# EAGLE design digibaro_v2 (EAGLE 9.4.0)
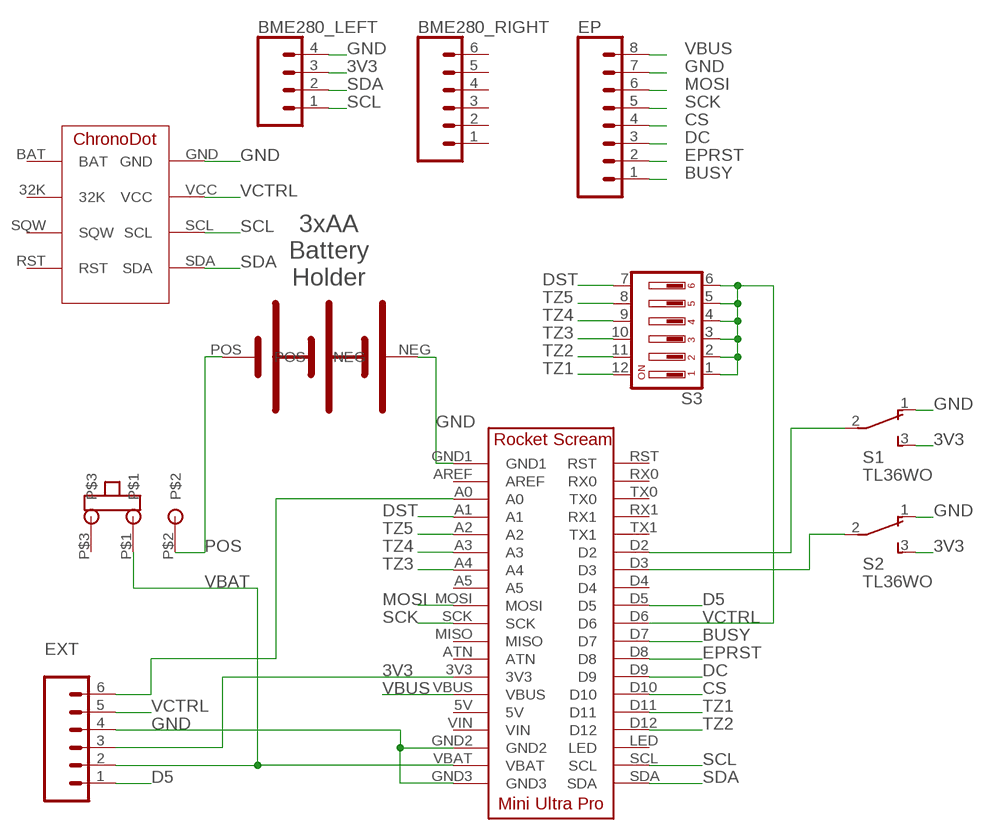
[diagram p0: schematic, sheet 1]

## Parts
BME280_LEFT  CONN_04  [1X04]
BME280_RIGHT  CONN_06SILK_FEMALE_PTH  [1X06]
EP  CONN_08"  [1X08]
EXT  CONN_06SILK_FEMALE_PTH  [1X06]
S1  TL36WO  [TL3XWO]
S2  TL36WO  [TL3XWO]
S3  DA06  [DA-06]
U$1  BATTERY-HOLDER_3AA  [BATTERY-HOLDER_3AA]
U$2  SLIDE-SWITCHNKKMINIATURE  [MS12ANG03]
U$3  ULTRA-MINI-PRO  [ULTRA-MINI-PRO_RECEIVER]
U$4  CHRONODOT  [CHRONODOT_RECEIVER]

## Nets
3V3: BME280_LEFT.3 EXT.3 S1.3(S) S2.3(S) U$3.3V3
A0: EXT.6 U$3.A0
BUSY: EP.1 U$3.D7
CS: EP.4 U$3.D10
D5: EXT.1 U$3.D5
DC: EP.3 U$3.D9
DST: S3.7 U$3.A1
EPRST: EP.2 U$3.D8
GND: BME280_LEFT.4 EP.7 EXT.4 S1.1(O) S2.1(O) U$1.NEG U$3.GND1 U$3.GND2 U$3.GND3 U$4.GND
MOSI: EP.6 U$3.MOSI
N$6: S1.2(P) U$3.D2
N$7: S2.2(P) U$3.D3
POS: U$1.POS U$2.P$2
SCK: EP.5 U$3.SCK
SCL: BME280_LEFT.1 U$3.SCL U$4.SCL
SDA: BME280_LEFT.2 U$3.SDA U$4.SDA
TZ1: S3.12 U$3.D11
TZ2: S3.11 U$3.D12
TZ3: S3.10 U$3.A4
TZ4: S3.9 U$3.A3
TZ5: S3.8 U$3.A2
VBAT: EXT.2 U$2.P$1 U$3.VBAT
VBUS: EP.8 U$3.VBUS
VCTRL: EXT.5 S3.1 S3.2 S3.3 S3.4 S3.5 S3.6 U$3.D6 U$4.VCC
Unconnected: BME280_RIGHT.1 BME280_RIGHT.2 BME280_RIGHT.3 BME280_RIGHT.4 BME280_RIGHT.5 BME280_RIGHT.6 U$2.P$3 U$3.5V U$3.A5 U$3.AREF U$3.ATN U$3.D4 U$3.LED U$3.MISO U$3.RST U$3.RX0 U$3.RX1 U$3.TX0 U$3.TX1 U$3.VIN U$4.32K U$4.BAT U$4.RST U$4.SQW

## Library data of the parts
BME280_LEFT = SparkFun-Connectors:CONN_04: Multi connection point. Often used as Generic Header-pin footprint for 0.1 inch spaced/style header connections On any of the 0.1 inch spaced packages, you can populate with these: Break Away Headers - Straight <https://www.sparkfun.com/products/116> (PRT-00116) Break Away Male Headers - Right Angle <https://www.sparkfun.com/products/553> (PRT-00553) Female Headers <https://www.sparkfun.com/products/115> (PRT-00115) Break Away Headers - Machine Pin <https://www.sparkfun.com/products/117> (PRT-00117) Break Away Female Headers - Swiss Machine Pin <https://www.sparkfun.com/products/743> (PRT-00743) For SCREWTERMINALS and SPRING TERMINALS visit here: Screw Terimnals on SparkFun.com <https://www.sparkfun.com/search/results?term=Screw+Terminals> (5mm/3.5mm/2.54mm spacing) This device is also useful as a general connection point to wire up your design to another part of your project. Our various solder wires solder well into these plated through hole pads. Hook-Up Wire - Assortment (Stranded, 22 AWG) <https://www.sparkfun.com/products/11375> (PRT-11375) Hook-Up Wire - Assortment (Solid Core, 22 AWG) <https://www.sparkfun.com/products/11367> (PRT-11367) View the entire wire category on our website here <https://www.sparkfun.com/categories/141> Special notes: Molex polarized connector foot print use with SKU : PRT-08231 with associated crimp pins and housings. 1MM SMD Version SKU: PRT-10208; PROD_ID: CONN-09696
BME280_RIGHT EXT = SparkFun-Connectors:CONN_06: Multi connection point. Often used as Generic Header-pin footprint for 0.1 inch spaced/style header connections On any of the 0.1 inch spaced packages, you can populate with these: Break Away Headers - Straight <https://www.sparkfun.com/products/116> (PRT-00116) Break Away Male Headers - Right Angle <https://www.sparkfun.com/products/553> (PRT-00553) Female Headers <https://www.sparkfun.com/products/115> (PRT-00115) Break Away Headers - Machine Pin <https://www.sparkfun.com/products/117> (PRT-00117) Break Away Female Headers - Swiss Machine Pin <https://www.sparkfun.com/products/743> (PRT-00743) Arduino Stackable Header - 6 Pin <https://www.sparkfun.com/products/9280> (PRT-09280) For SCREWTERMINALS and SPRING TERMINALS visit here: Screw Terimnals on SparkFun.com <https://www.sparkfun.com/search/results?term=Screw+Terminals> (5mm/3.5mm/2.54mm spacing) This device is also useful as a general connection point to wire up your design to another part of your project. Our various solder wires solder well into these plated through hole pads. Hook-Up Wire - Assortment (Stranded, 22 AWG) <https://www.sparkfun.com/products/11375> (PRT-11375) Hook-Up Wire - Assortment (Solid Core, 22 AWG) <https://www.sparkfun.com/products/11367> (PRT-11367) View the entire wire category on our website here <https://www.sparkfun.com/categories/141>; PROD_ID: CONN-08437
EP = SparkFun-Connectors:CONN_08: Multi connection point. Often used as Generic Header-pin footprint for 0.1 inch spaced/style header connections On any of the 0.1 inch spaced packages, you can populate with these: Break Away Headers - Straight <https://www.sparkfun.com/products/116> (PRT-00116) Break Away Male Headers - Right Angle <https://www.sparkfun.com/products/553> (PRT-00553) Female Headers <https://www.sparkfun.com/products/115> (PRT-00115) Break Away Headers - Machine Pin <https://www.sparkfun.com/products/117> (PRT-00117) Break Away Female Headers - Swiss Machine Pin <https://www.sparkfun.com/products/743> (PRT-00743) Arduino Stackable Header - 8 Pin <https://www.sparkfun.com/products/9279> (PRT-09279) For SCREWTERMINALS and SPRING TERMINALS visit here: Screw Terimnals on SparkFun.com <https://www.sparkfun.com/search/results?term=Screw+Terminals> (5mm/3.5mm/2.54mm spacing) This device is also useful as a general connection point to wire up your design to another part of your project. Our various solder wires solder well into these plated through hole pads. Hook-Up Wire - Assortment (Stranded, 22 AWG) <https://www.sparkfun.com/products/11375> (PRT-11375) Hook-Up Wire - Assortment (Solid Core, 22 AWG) <https://www.sparkfun.com/products/11367> (PRT-11367) View the entire wire category on our website here <https://www.sparkfun.com/categories/141> Special notes: Molex polarized connector foot print use with SKU : PRT-08231 with associated crimp pins and housings. 1MM SMD Version SKU: PRT-10208 NOTES ON THE VARIANTS LOCK and LOCK_LONGPADS... This footprint was designed to help hold the alignment of a through-hole component (i.e. 6-pin header) while soldering it into place. You may notice that each hole has been shifted either up or down by 0.005 of an inch from it's more standard position (which is a perfectly straight line). This slight alteration caused the pins (the squares in the middle) to touch the edges of the holes. Because they are alternating, it causes a "brace" to hold the component in place. 0.005 has proven to be the perfect amount of "off-center" position when using our standard breakaway headers. Although looks a little odd when you look at the bare footprint, once you have a header in there, the alteration is very hard to notice. Also,if you push a header all the way into place, it is covered up entirely on the bottom side.; PROD_ID: CONN-08438
S1 S2 = switch:TL36WO: TINY SWITCH ON - ON Source: http://www2.produktinfo.conrad.com/datenblaetter/700000-724999/705152-da-01-de-Subminiaturschalter_TL_36WO.pdf
S3 = switch-dil:DA06: DIL/CODE SWITCH; MPN: MCDA06; OC_FARNELL: 9471553; OC_NEWARK: 26M1091
U$1 = flupes:BATTERY-HOLDER_3AA
U$2 = flupes:SLIDE-SWITCH
U$3 = flupes:ULTRA-MINI-PRO
U$4 = flupes:CHRONODOT

## Board
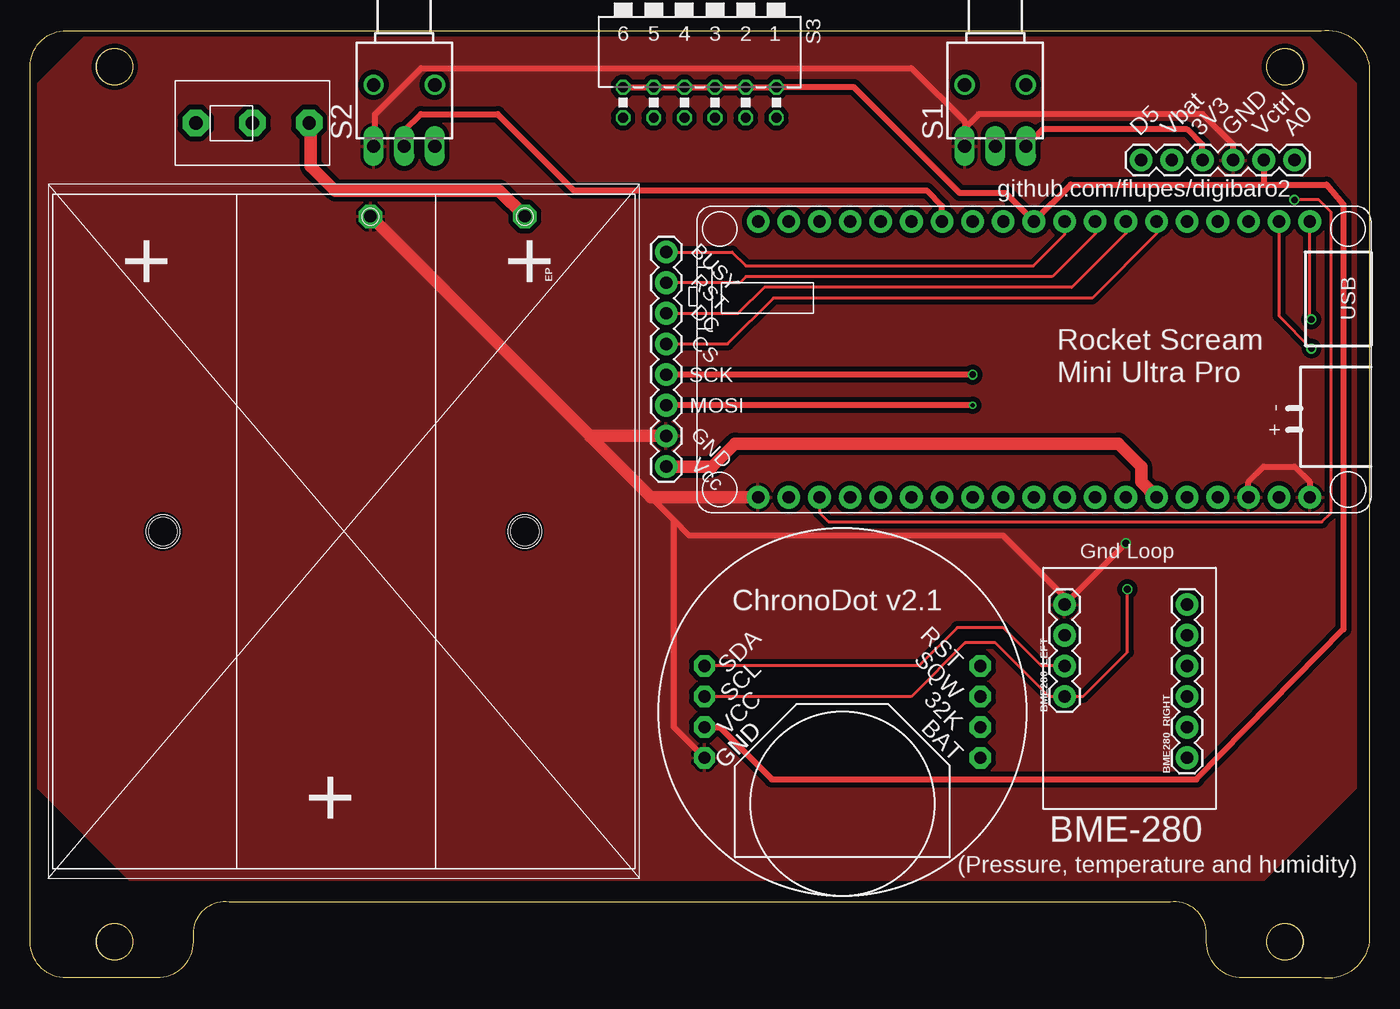
[diagram p1: board, top side]
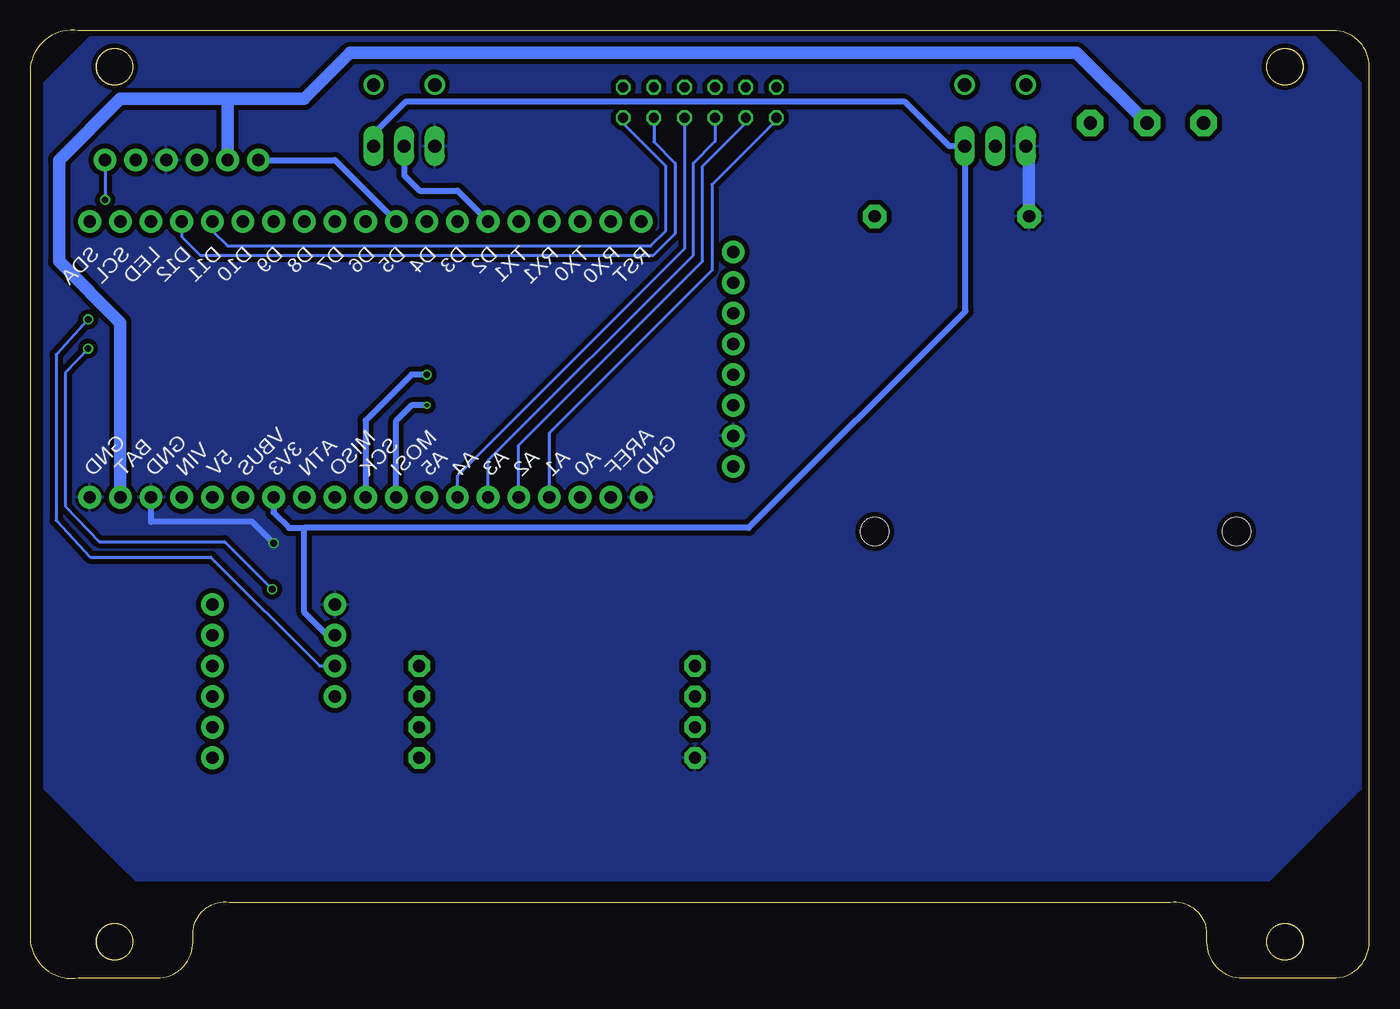
[diagram p2: board, bottom side, seen from below]

Size 111 x 78.56 mm. Coordinates in mm from the lower left corner, seen from the top.
Outline: 3,78.53 107,78.53 arc-90 111,75.53 111,3.03 arc-90 107,0.03 100.5,0.03 arc-90 97.5,3.03 97.5,3.95 arc90 94.5,6.32 16.5,6.32 arc90 13.5,3.95 13.5,3.03 arc-90 10.5,0.03 3,0.03 arc-90 0,3.03 0,75.53 arc-90 3,78.53
Outline: circle at 104,75.53 radius 1.5
Outline: circle at 7,75.53 radius 1.5
Outline: circle at 104,3.03 radius 1.5
Outline: circle at 7,3.03 radius 1.5
Copper layers (1*16): Top 0.035559375mm / dielectric 1.6mm / Bottom 0.035559375mm
Design rules "oshpark-2layer": minimum track width 6mil, minimum drill 10mil, track to track 6mil, track to pad 6mil, pad to pad 6mil, via to via 6mil, smd to smd 6mil, copper to edge 15mil, drill to drill 6mil, minimum pad ring 5mil, minimum via ring 5mil, stop-mask expansion 2.5mil, vias tented up to drill 0mil, thermal gap 10mil
Holes 3 mm at 7,75.53 7,3.03 104,75.53 104,3.03

### Footprints (pad centres in the part's own frame; a part is rotated, then mirrored left to right if it is on the bottom)
1X04 = drill 1.016 pad 1.88: 1 0,0; 2 2.54,0; 3 5.08,0; 4 7.62,0
1X06 = drill 1.016 pad 1.88: 1 0,0; 2 2.54,0; 3 5.08,0; 4 7.62,0; 5 10.16,0; 6 12.7,0
1X08 = drill 1.016 pad 1.88: 1 0,0; 2 2.54,0; 3 5.08,0; 4 7.62,0; 5 10.16,0; 6 12.7,0; 7 15.24,0; 8 17.78,0
TL3XWO = drill 1.1 pad 1.422 long: 1 -2.54,-5.08; 2 0,-5.08; 3 2.54,-5.08 | drill 1.1 pad 1.676: M1 -2.54,0; M2 2.54,0
DA-06 = drill 0.813 octagon: 1 -6.35,-1.27; 2 -3.81,-1.27; 3 -1.27,-1.27; 4 1.27,-1.27; 5 3.81,-1.27; 6 6.35,-1.27; 7 6.35,1.27; 8 3.81,1.27; 9 1.27,1.27; 10 -1.27,1.27; 11 -3.81,1.27; 12 -6.35,1.27
BATTERY-HOLDER_3AA = drill 1 pad 1.93 octagon: NEG 26.1,-2.2; POS 26.1,-15 | hole 2.37: 0,15; 0,-15
MS12ANG03 = drill 1.1 pad 2.184 octagon: P$1 0,0; P$2 -4.7,0; P$3 4.7,0
ULTRA-MINI-PRO_RECEIVER = drill 1.016 pad 1.88: 3V3 -11.43,-7.62; 5V -11.43,-12.7; A0 -11.43,17.78; A1 -11.43,15.24; A2 -11.43,12.7; A3 -11.43,10.16; A4 -11.43,7.62; A5 -11.43,5.08; AREF -11.43,20.32; ATN -11.43,-5.08; D2 11.43,10.16; D3 11.43,7.62; D4 11.43,5.08; D5 11.43,2.54; D6 11.43,0; D7 11.43,-2.54; D8 11.43,-5.08; D9 11.43,-7.62; D10 11.43,-10.16; D11 11.43,-12.7; D12 11.43,-15.24; GND1 -11.43,22.86; GND2 -11.43,-17.78; GND3 -11.43,-22.86; LED 11.43,-17.78; MISO -11.43,-2.54; MOSI -11.43,2.54; RST 11.43,22.86; RX0 11.43,20.32; RX1 11.43,15.24; SCK -11.43,0; SCL 11.43,-20.32; SDA 11.43,-22.86; TX0 11.43,17.78; TX1 11.43,12.7; VBAT -11.43,-20.32; VBUS -11.43,-10.16; VIN -11.43,-15.24
CHRONODOT_RECEIVER = drill 1.016 pad 1.778 octagon: 32K -11.43,1.27; BAT -11.43,3.81; GND 11.43,3.81; RST -11.43,-3.81; SCL 11.43,-1.27; SDA 11.43,-3.81; SQW -11.43,-1.27; VCC 11.43,1.27

### Placement (x,y rotation side)
BME280_LEFT  85.74,23.35 90 top
BME280_RIGHT  95.9,18.27 90 top
EP  52.72,60.18 270 top
EXT  92.09,67.8 0 top
S1  80,74.03 0 top
S2  31,74.03 0 top
S3  55.5,72.57 180 top
U$1  26,37.03 90 top
U$2  18.43,70.88 180 top
U$3  83.2,51.29 90 top
U$4  67.33,22.08 180 top

### Tracks (layer width: path | path; a pad name or v marks a point on that pad's centre or on a via)
3V3
  Top 0.508: EXT.3 97.17,69.07 95.9,70.34 83.93,70.34 S1.3
  Bottom 0.508: BME280_LEFT.3 86.38,28.43 88.28,30.34 88.28,37.32 | 88.28,37.32 51.45,37.32 33.48,55.29 33.48,68.89 S2.3 34.82,68.95 38.5,72.63 79.9,72.63 82.54,69.99 S1.3 | U$3.3V3 90.82,38.59 89.55,37.32 88.28,37.32
A0  (via drill 0.55)
  Top 0.254: U$3.A0 65.42,38.59 66.18,37.83 107.08,37.83 107.84,38.59 107.84,63.48 106.82,64.5 v104.79,64.5
  Bottom 0.254: EXT.6 v104.79,64.5
BUSY
  Top 0.254: EP.1 58.18,60.18 59.32,59.04 83.16,59.04 85.74,61.62 U$3.D7
CS
  Top 0.254: EP.4 57.8,52.56 61.61,56.37 88.03,56.37 93.36,61.71 U$3.D10
D5
  Bottom 0.508: EXT.1 85.74,67.8 U$3.D5
DC
  Top 0.254: EP.3 58.69,55.1 60.85,57.26 86.34,57.26 90.82,61.74 U$3.D9
DST
  Bottom 0.254: S3.7 49.15,71.12 54.5,65.77 54.5,58.66 67.96,45.2 U$3.A1
EPRST
  Top 0.254: EP.2 58.82,57.64 59.32,58.15 84.72,58.15 88.28,61.71 U$3.D8
GND  (via drill 0.55)
  Top 0.508: U$4.GND 53.35,20.81 53.35,37.96 | EXT.4 99.71,69.07 97.17,71.61 78.63,71.61 77.46,70.44 S1.1 77.46,71 73.04,75.42 32.4,75.42 28.59,71.61 28.59,69.08 S2.1 | 53.35,37.96 54.62,36.69 80.66,36.69 85.74,31.61 BME280_LEFT.4 v90.82,36.05 | 53.35,37.96 51.45,39.86 | U$3.GND2 100.98,41.13 102.25,42.4 104.79,42.4 106.06,41.13 U$3.GND3
  Top 1.016: 46.39,44.94 EP.7 | 46.39,44.94 U$1.NEG | U$3.GND1 51.45,39.86 46.39,44.92 46.39,44.94
  Bottom 0.508: 28.2,68.69 S2.1 | U$3.GND2 100.98,37.83 92.6,37.83 v90.82,36.05
  Bottom 1.016: U$1.NEG 28.2,68.69
  pour Top (isolate 0.406): 5.73,77.96 106.06,77.96 109.87,74.15 109.87,15.73 102.25,8.11 8.27,8.11 0.65,15.73 0.65,74.15 4.46,77.96
  pour Bottom (isolate 0.406): 4.46,77.96 106.06,77.96 109.87,74.15 109.87,15.73 103.52,9.38 102.25,8.11 8.27,8.11 0.65,15.73 0.65,74.15
MOSI  (via drill 0.35)
  Top 0.508: v78.12,47.48 EP.6
  Bottom 0.508: U$3.MOSI 80.66,46.21 79.39,47.48 v78.12,47.48
N$6
  Bottom 0.508: S1.2 80,66.53 78.73,65.26 75.58,65.26 U$3.D2
N$7
  Top 0.508: S2.2 31,70.21 32.4,71.61 38.75,71.61 45.1,65.26 74.31,65.26 75.58,63.99 U$3.D3
POS
  Top 1.016: U$1.POS 38.87,65.26 25.29,65.26 23.26,67.29 23.26,70.76 U$2.P$2
SCK  (via drill 0.55)
  Top 0.508: v78.12,50.02 EP.5
  Bottom 0.508: U$3.SCK 83.2,46.21 79.39,50.02 v78.12,50.02
SCL  (via drill 0.55)
  Top 0.254: U$4.SCL 73.04,23.35 77.48,27.8 80.03,27.8 84.47,23.35 BME280_LEFT.1 87.26,23.35 90.95,27.04 v90.95,32.24 | v106.2,52.18 103.52,54.86 U$3.SCL
  Bottom 0.254: v106.2,52.18 108.09,50.17 108.09,39.14 105.27,36.18 94.88,36.18 v90.95,32.24
SDA  (via drill 0.55)
  Top 0.254: BME280_LEFT.2 83.83,25.89 80.66,29.07 76.85,29.07 73.67,25.89 U$4.SDA | v106.19,54.59 106.06,54.72 U$3.SDA
  Bottom 0.254: v106.19,54.59 108.85,51.67 108.85,37.94 106.04,34.91 96.03,34.91 87.01,25.89 BME280_LEFT.2
TZ1
  Bottom 0.254: S3.12 61.85,70.84 58.31,67.29 58.31,61.96 59.58,60.69 94.63,60.69 95.9,61.96 U$3.D11
TZ2
  Bottom 0.254: S3.11 59.31,69.31 57.55,67.55 57.55,61.71 59.32,59.93 96.92,59.93 98.44,61.45 U$3.D12
TZ3
  Bottom 0.254: S3.10 56.77,60.45 75.58,41.64 U$3.A4
TZ4
  Bottom 0.254: S3.9 54.23,69.34 56.02,67.55 56.02,59.93 73.04,42.91 U$3.A3
TZ5
  Bottom 0.254: S3.8 51.69,70.86 55.26,67.29 55.26,59.42 70.5,44.18 U$3.A2
VBAT
  Bottom 1.016: 94.63,72.88 103.52,72.88 108.6,67.8 108.6,59.42 103.52,54.34 U$3.VBAT | 94.63,72.88 88.28,72.88 84.47,76.69 24.27,76.69 18.46,70.88 U$2.P$1 | EXT.2 94.63,72.88
VBUS
  Top 1.016: EP.8 56.53,42.4 58.44,44.31 90.19,44.31 92.09,42.4 92.09,41.13 U$3.VBUS
VCTRL
  Top 0.508: 102.25,65.77 86.25,65.77 U$3.D6 80.84,65.08 77.03,65.08 68.27,73.84 S3.1 S3.2 S3.3 S3.4 S3.5 S3.6 | 102.25,65.77 107.46,65.77 108.85,64.14 108.85,28.92 96.66,16.49 61.48,16.49 57.16,20.81 U$4.VCC | EXT.5 102.25,65.77

### Text on the board
tPlace: D5 | Vbat | 3V3 | GND | Vctrl | A0 | github.com/flupes/digibaro2 | BUSY | RST | DC | CS | SCK | MOSI | GND | Vcc | BME-280 | (Pressure, temperature and humidity)
tNames: Gnd Loop
tDocu: July 2019: / Special Edition / "VAI" | Digibaro v1.0